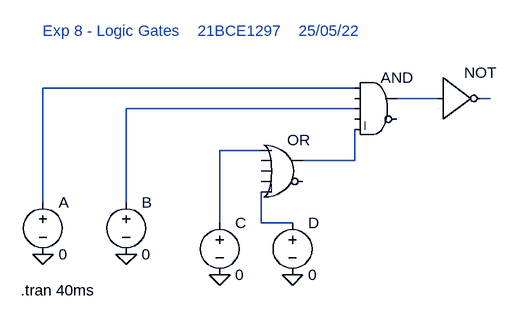
[diagram p0: schematic Expression1.asc]
Expression1.asc, the LTspice schematic file:
Version 4
SHEET 1 880 680
WIRE 448 0 -32 0
WIRE 576 16 512 16
WIRE 656 16 640 16
WIRE 448 32 96 32
WIRE 304 96 240 96
WIRE 448 112 448 64
WIRE 448 112 368 112
WIRE -32 176 -32 0
WIRE 96 176 96 32
WIRE 240 208 240 96
WIRE 304 208 304 160
WIRE 352 208 304 208
FLAG -32 256 0
FLAG 96 256 0
FLAG 240 288 0
FLAG 352 288 0
SYMBOL voltage -32 160 R0
SYMATTR InstName A
SYMATTR Value 0
SYMBOL voltage 96 160 R0
SYMATTR InstName B
SYMATTR Value 0
SYMBOL Digital\\and 480 -32 R0
SYMATTR InstName AND
SYMBOL voltage 240 192 R0
SYMATTR InstName C
SYMATTR Value 0
SYMBOL voltage 352 192 R0
SYMATTR InstName D
SYMATTR Value 0
SYMBOL Digital\\or 336 64 R0
SYMATTR InstName OR
SYMBOL Digital\\inv 576 -48 R0
SYMATTR InstName NOT
TEXT -32 -88 Left 2 ;Exp 8 - Logic Gates    21BCE1297    25/05/22
TEXT -66 312 Left 2 !.tran 40ms

The netlist it stands for:
* Expression1.asc
V§A N001 0 0
V§B N004 0 0
AND N001 0 N004 0 N006 0 N002 0 AND
V§C N005 0 0
V§D N007 0 0
A§OR N005 0 0 0 N007 0 N006 0 OR
A§NOT N002 0 0 0 0 N003 0 0 BUF
* Exp 8 - Logic Gates    21BCE1297    25/05/22
.tran 40ms
.backanno
.end